# EAGLE design XenoGC-mini (EAGLE 6.5.0)
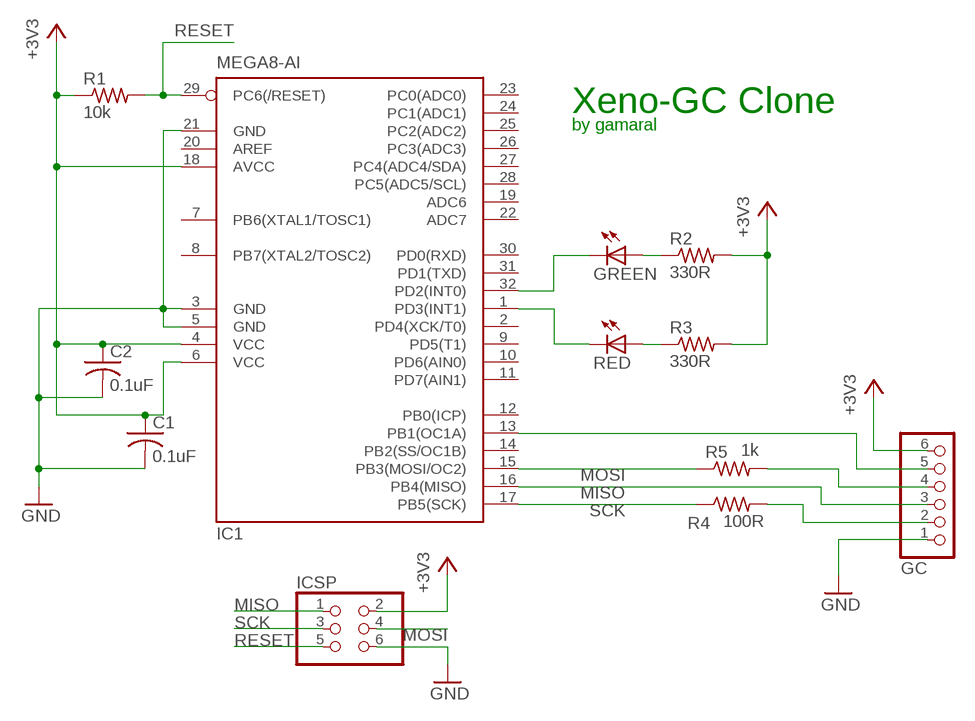
[diagram p0: schematic, sheet 1]

## Parts
C1  0.1uF  C-USC0805K  [C0805K]
C2  0.1uF  C-USC0805K  [C0805K]
GC  PINHD-1X6/90  [1X06/90]
GREEN  LEDSML1206  [SML1206]
IC1  MEGA8-AI  [TQFP32-08]
ICSP  PINHD-2X3  [2X03]
R1  10k  R-US_R0805W  [R0805W]
R2  330R  R-US_R0805W  [R0805W]
R3  330R  R-US_R0805W  [R0805W]
R4  100R  R-US_R0805W  [R0805W]
R5  1k  R-US_R0805W  [R0805W]
RED  LEDSML1206  [SML1206]

## Nets
+3V3: C1.1 C2.1 GC.6 IC1.4(VCC) IC1.6(VCC) IC1.18(AVCC) ICSP.2 R1.1 R2.2 R3.2
GC2: GC.2 R4.2
GC3: GC.4 R5.2
GND: C1.2 C2.2 GC.1 IC1.3(GND) IC1.5(GND) IC1.21(GND) ICSP.6
LED1: GREEN.C IC1.32(PD2(INT0))
LED2: IC1.1(PD3(INT1)) RED.C
MISO: GC.3 IC1.16(PB4(MISO)) ICSP.1
MOSI: IC1.15(PB3(MOSI/OC2)) ICSP.4 R5.1
N$3: GREEN.A R2.1
N$4: R3.1 RED.A
PB1: GC.5 IC1.13(PB1(OC1A))
RESET: IC1.29(PC6(/RESET)) ICSP.5 R1.2
SCK: IC1.17(PB5(SCK)) ICSP.3 R4.1
Unconnected: IC1.2(PD4(XCK/T0)) IC1.7(PB6(XTAL1/TOSC1)) IC1.8(PB7(XTAL2/TOSC2)) IC1.9(PD5(T1)) IC1.10(PD6(AIN0)) IC1.11(PD7(AIN1)) IC1.12(PB0(ICP)) IC1.14(PB2(SS/OC1B)) IC1.19(ADC6) IC1.20(AREF) IC1.22(ADC7) IC1.23(PC0(ADC0)) IC1.24(PC1(ADC1)) IC1.25(PC2(ADC2)) IC1.26(PC3(ADC3)) IC1.27(PC4(ADC4/SDA)) IC1.28(PC5(ADC5/SCL)) IC1.30(PD0(RXD)) IC1.31(PD1(TXD))

## Notes on the sheet
- Xeno-GC Clone
- by gamaral

## Library data of the parts
C1 C2 = resistor:C-US: CAPACITOR, American symbol
GC = pinhead:PINHD-1X6: PIN HEADER
GREEN RED = led:LED: LED OSRAM: - CHIPLED LG R971, LG N971, LY N971, LG Q971, LY Q971, LO R971, LY R971 LH N974, LH R974 LS Q976, LO Q976, LY Q976 LO Q996 - Hyper CHIPLED LW Q18S LB Q993, LB Q99A, LB R99A - SideLED LS A670, LO A670, LY A670, LG A670, LP A670 LB A673, LV A673, LT A673, LW A673 LH A674 LY A675 LS A676, LA A676, LO A676, LY A676, LW A676 LS A679, LY A679, LG A679 - Hyper Micro SIDELED® LS Y876, LA Y876, LO Y876, LY Y876 LT Y87S - SmartLED LW L88C, LW L88S LB L89C, LB L89S, LG L890 LS L89K, LO L89K, LY L89K LS L896, LA L896, LO L896, LY L896 - TOPLED LS T670, LO T670, LY T670, LG T670, LP T670 LSG T670, LSP T670, LSY T670, LOP T670, LYG T670 LG T671, LOG T671, LSG T671 LB T673, LV T673, LT T673, LW T673 LH T674 LS T676, LA T676, LO T676, LY T676, LB T676, LH T676, LSB T676, LW T676 LB T67C, LV T67C, LT T67C, LS T67K, LO T67K, LY T67K, LW E67C LS E67B, LA E67B, LO E67B, LY E67B, LB E67C, LV E67C, LT E67C LW T67C LS T679, LY T679, LG T679 LS T770, LO T770, LY T770, LG T770, LP T770 LB T773, LV T773, LT T773, LW T773 LH T774 LS E675, LA E675, LY E675, LS T675 LS T776, LA T776, LO T776, LY T776, LB T776 LHGB T686 LT T68C, LB T68C - Hyper Mini TOPLED® LB M676 - Mini TOPLED Santana® LG M470 LS M47K, LO M47K, LY M47K Source: http://www.osram.convergy.de LUXEON: - LUMILED® LXK2-PW12-R00, LXK2-PW12-S00, LXK2-PW14-U00, LXK2-PW14-V00 LXK2-PM12-R00, LXK2-PM12-S00, LXK2-PM14-U00 LXK2-PE12-Q00, LXK2-PE12-R00, LXK2-PE12-S00, LXK2-PE14-T00, LXK2-PE14-U00 LXK2-PB12-K00, LXK2-PB12-L00, LXK2-PB12-M00, LXK2-PB14-N00, LXK2-PB14-P00, LXK2-PB14-Q00 LXK2-PR12-L00, LXK2-PR12-M00, LXK2-PR14-Q00, LXK2-PR14-R00 LXK2-PD12-Q00, LXK2-PD12-R00, LXK2-PD12-S00 LXK2-PH12-R00, LXK2-PH12-S00 LXK2-PL12-P00, LXK2-PL12-Q00, LXK2-PL12-R00 Source: www.luxeon.com KINGBRIGHT: KA-3528ASYC Source: www.kingbright.com
IC1 = atmel:MEGA8: MICROCONTROLLER 8 Kbytes FLASH, 1 kbytes SRAM, 512 bytes EEPROM, USART, 6-channel 10 bit ADC, 2-channel 8 bit ADC Pin compatible with Atmega48, ATMega88, ATMega168 Source: avr.lbr; MPN: ATMEGA8-16AU; OC_FARNELL: 9171371; OC_NEWARK: 73M8863
ICSP = pinhead:PINHD-2X3: PIN HEADER
R1-R5 = resistor:R-US_: RESISTOR, American symbol

## Board
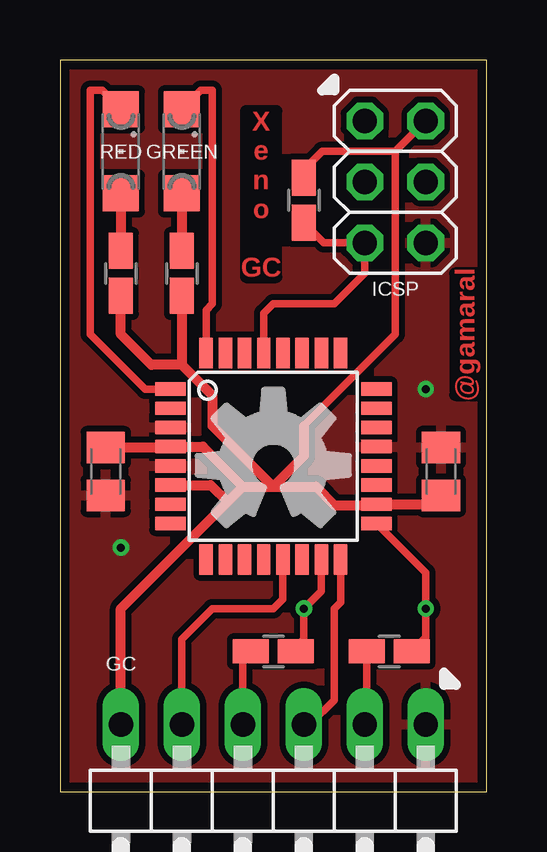
[diagram p1: board, top side]
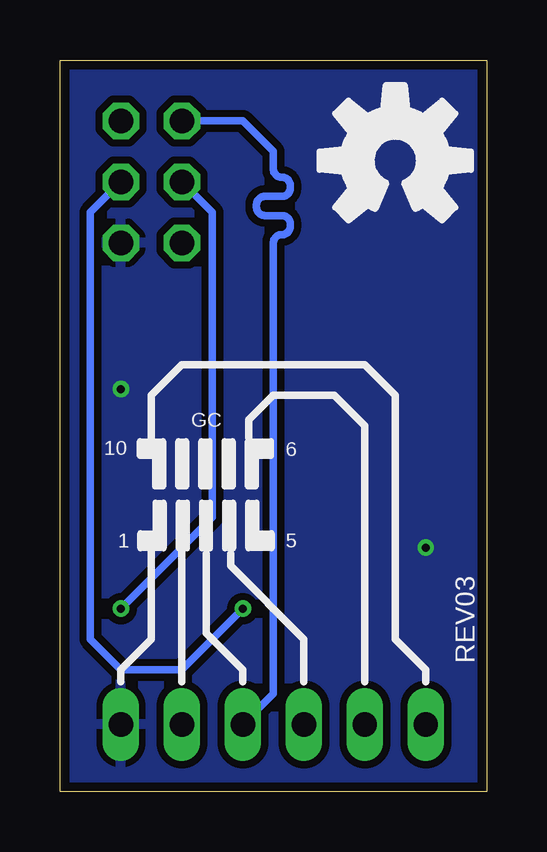
[diagram p2: board, bottom side, seen from below]

Size 17.78 x 30.48 mm. Coordinates in mm from the lower left corner, seen from the top.
Outline: 0,0 17.78,0 17.78,30.48 0,30.48 0,0
Copper layers (1*16): Top 0.0356mm / dielectric 1.5011mm / Bottom 0.0356mm
Design rules "LaenPCBOrder": minimum track width 6mil, minimum drill 13mil, track to track 6mil, track to pad 6mil, pad to pad 6mil, via to via 6mil, smd to smd 6mil, copper to edge 15mil, drill to drill 6mil, minimum pad ring 7mil, minimum via ring 7mil, stop-mask expansion 4mil, vias tented up to drill 0mil, thermal gap 10mil

### Footprints (pad centres in the part's own frame; a part is rotated, then mirrored left to right if it is on the bottom)
C0805K = smd 1.3 x 1.6: 1 -1,0; 2 1,0
1X06/90 = drill 1.016 long: 1 -6.35,-3.81; 2 -3.81,-3.81; 3 -1.27,-3.81; 4 1.27,-3.81; 5 3.81,-3.81; 6 6.35,-3.81
SML1206 = smd 1.5 x 1.5: A 1.75,0; C -1.75,0
TQFP32-08 = smd 1.27 x 0.559: 1 -4.293,2.8; 2 -4.293,2; 3 -4.293,1.2; 4 -4.293,0.4; 5 -4.293,-0.4; 6 -4.293,-1.2; 7 -4.293,-2; 8 -4.293,-2.8; 17 4.293,-2.8; 18 4.293,-2; 19 4.293,-1.2; 20 4.293,-0.4; 21 4.293,0.4; 22 4.293,1.2; 23 4.293,2; 24 4.293,2.8 | smd 0.559 x 1.27: 9 -2.8,-4.293; 10 -2,-4.293; 11 -1.2,-4.293; 12 -0.4,-4.293; 13 0.4,-4.293; 14 1.2,-4.293; 15 2,-4.293; 16 2.8,-4.293; 25 2.8,4.293; 26 2,4.293; 27 1.2,4.293; 28 0.4,4.293; 29 -0.4,4.293; 30 -1.2,4.293; 31 -2,4.293; 32 -2.8,4.293
2X03 = drill 1.016 octagon: 1 -2.54,-1.27; 2 -2.54,1.27; 3 0,-1.27; 4 0,1.27; 5 2.54,-1.27; 6 2.54,1.27
R0805W = smd 1.5 x 1: 1 -0.94,0; 2 0.94,0

### Placement (x,y rotation side)
C1  15.88,13.34 90 top
C2  1.91,13.34 270 top
GC  8.89,-1.02 180 top
GREEN  5.08,26.67 270 top
IC1  8.89,13.97 0 top
ICSP  13.97,25.4 270 top
R1  10.16,24.64 270 top
R2  5.08,21.59 270 top
R3  2.54,21.59 270 top
R4  13.72,5.84 180 top
R5  8.89,5.84 180 top
RED  2.54,26.67 270 top

### Tracks (layer width: path | path; a pad name or v marks a point on that pad's centre or on a via)
+3V3
  Top 0.305: 10.16,15.24 13.97,19.05 13.97,26.67 | 13.97,26.67 ICSP.2 | 13.97,26.67 10.92,26.67 10.16,25.91 R1.1
  Top 0.406: GC.6 2.54,7.62 6.99,12.06 | 6.99,12.06 7.62,12.7 | 7.62,12.7 8.89,12.7 | 8.89,12.7 10.67,12.7 11.43,11.94 13.15,11.94 IC1.18 15.51,11.97 C1.1 | IC1.6 6.28,12.77 6.99,12.06 | C2.1 4.56,14.34 IC1.4 5.95,14.37 7.62,12.7 | 8.89,12.7 6.35,15.24 6.35,16.51 5.08,17.78 | 10.16,15.24 10.16,13.97 8.89,12.7 | 5.08,17.78 3.81,17.78 2.54,19.05 R3.2 | R2.2 5.08,17.78
GC2
  Top 0.305: GC.2 12.78,2.87 R4.2
GC3
  Top 0.305: 7.62,5.51 GC.4
  Top 0.406: 7.62,6.02 R5.2 7.62,5.51
GND  (via drill 0.33)
  other vias: 15.24,16.76 2.54,10.16
  pour Top (isolate 0.254): 0,30.48 0,0 17.78,0 17.78,30.48
  pour Bottom (isolate 0.305): 0,30.48 17.78,30.48 17.78,0 0,0
LED1
  Top 0.305: GREEN.C 5.87,29.21 6.35,29.21 6.35,20.32 6.09,20.06 IC1.32
LED2
  Top 0.305: RED.C 1.75,29.21 1.27,29.21 1.27,19.05 3.55,16.77 IC1.1
MISO
  Top 0.305: IC1.16 11.69,7.88 11.43,7.62 11.43,3.81 10.41,2.79 GC.3
  Bottom 0.305: ICSP.1 10.16,27.94 8.89,26.67 8.89,25.94 arc-90 8.55,25.59 8.53,25.59 arc90 8.19,25.25 8.19,25.14 arc90 8.53,24.8 9.25,24.8 arc-90 9.59,24.45 9.59,24.34 arc-90 9.25,24 8.53,24 arc90 8.19,23.66 8.19,23.55 arc90 8.53,23.2 8.55,23.2 arc-90 8.89,22.86 8.89,4.06 GC.3
MOSI  (via drill 0.33)
  Top 0.305: IC1.15 10.89,8.35 v10.16,7.62 10.16,6.35 9.83,6.02 R5.1
  Bottom 0.305: v10.16,7.62 12.7,5.08 15.24,5.08 16.51,6.35 16.51,24.13 ICSP.4
N$3
  Top 0.406: GREEN.A R2.1
N$4
  Top 0.406: RED.A R3.1
PB1
  Top 0.305: IC1.13 9.29,8.02 8.89,7.62 6.35,7.62 5.08,6.35 GC.5
RESET
  Top 0.305: IC1.29 8.49,19.92 8.89,20.32 11.43,20.32 12.7,21.59 ICSP.5 11,22.86 R1.2
SCK  (via drill 0.33)
  Top 0.305: 14.73,5.92 R4.1 15.24,6.43 v15.24,7.62 15.24,9.11 IC1.17
  Bottom 0.305: ICSP.3 11.43,24.13 11.43,11.43 v15.24,7.62

### Text on the board
Top: X / e / n / o / / GC | @gamaral
bPlace: GC | 6 | 10 | 5 | 1
bNames: REV03